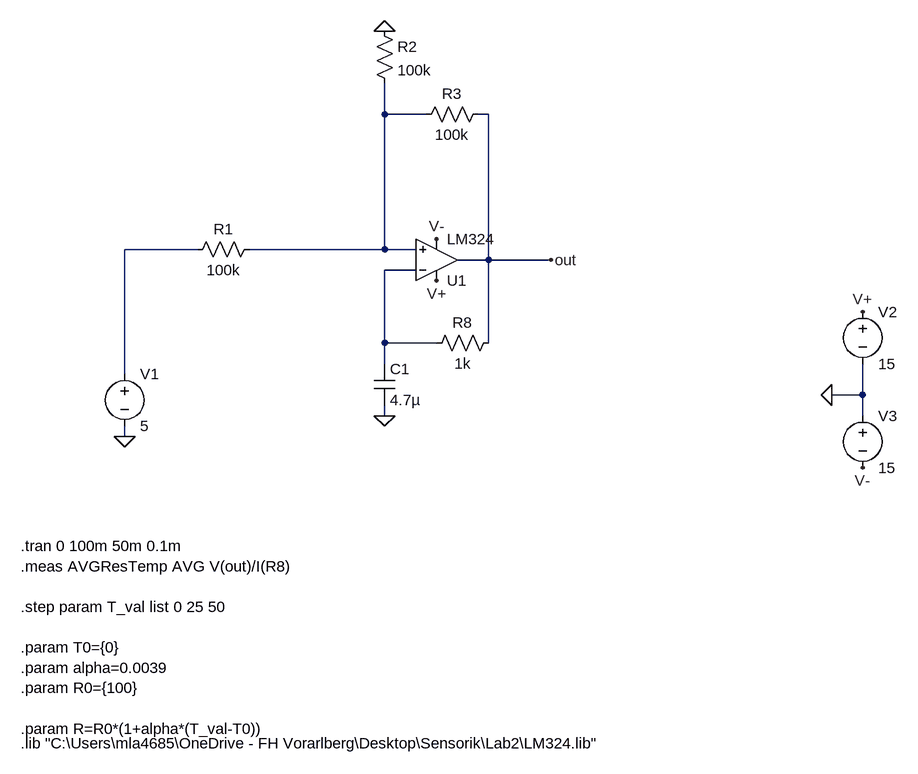
[diagram p0: schematic Umgebung 2.asc]
Umgebung 2.asc, the LTspice schematic file:
Version 4.1
SHEET 1 1784 680
WIRE 432 -320 432 -368
WIRE 496 -320 432 -320
WIRE 592 -320 576 -320
WIRE 144 -112 32 -112
WIRE 432 -112 432 -320
WIRE 432 -112 224 -112
WIRE 480 -112 432 -112
WIRE 592 -96 592 -320
WIRE 592 -96 544 -96
WIRE 688 -96 592 -96
WIRE 480 -80 432 -80
WIRE 432 32 432 -80
WIRE 512 32 432 32
WIRE 592 32 592 -96
WIRE 432 64 432 32
WIRE 32 80 32 -112
WIRE 1168 112 1168 64
WIRE 1168 112 1120 112
WIRE 432 144 432 128
WIRE 1168 144 1168 112
WIRE 32 176 32 160
FLAG 688 -96 out
FLAG 32 176 0
FLAG 1120 112 0
FLAG 1168 -16 V+
FLAG 1168 224 V-
FLAG 512 -128 V-
FLAG 512 -64 V+
FLAG 432 144 0
FLAG 432 -448 0
SYMBOL voltage 32 64 R0
SYMATTR InstName V1
SYMATTR Value 5
SYMBOL res 608 16 R90
WINDOW 0 0 56 VBottom 2
WINDOW 3 32 56 VTop 2
SYMATTR InstName R8
SYMATTR Value 1k
SYMBOL voltage 1168 -32 R0
SYMATTR InstName V2
SYMATTR Value 15
SYMBOL voltage 1168 128 R0
SYMATTR InstName V3
SYMATTR Value 15
SYMBOL res 240 -128 R90
WINDOW 0 0 56 VBottom 2
WINDOW 3 32 56 VTop 2
SYMATTR InstName R1
SYMATTR Value 100k
SYMBOL cap 416 64 R0
SYMATTR InstName C1
SYMATTR Value 4.7µ
SYMBOL res 416 -464 R0
SYMATTR InstName R2
SYMATTR Value 100k
SYMBOL res 592 -336 R90
WINDOW 0 0 56 VBottom 2
WINDOW 3 32 56 VTop 2
SYMATTR InstName R3
SYMATTR Value 100k
SYMBOL Opamps\\opamp2 512 -32 M180
SYMATTR InstName U1
SYMATTR Value LM324
SYMATTR SpiceModel LM324
TEXT -128 344 Left 2 !.tran 0 100m 50m 0.1m
TEXT -128 376 Left 2 !.meas AVGResTemp AVG V(out)/I(R8)\n \n.step param T_val list 0 25 50\n \n.param T0={0}\n.param alpha=0.0039\n.param R0={100}\n \n.param R=R0*(1+alpha*(T_val-T0))
TEXT -128 648 Left 2 !.lib "C:\\Users\\mla4685\\OneDrive - FH Vorarlberg\\Desktop\\Sensorik\\Lab2\\LM324.lib"

The netlist it stands for:
* Umgebung 2.asc
V1 N002 0 5
R8 out N003 1k
V2 V+ 0 15
V3 0 V- 15
R1 N001 N002 100k
C1 N003 0 4.7µ
R2 0 N001 100k
R3 out N001 100k
X§U1 N001 N003 V+ V- out LM324 LM324  ; pins In+ In- V+ V- OUT
.tran 0 100m 50m 0.1m
.meas AVGResTemp AVG V(out)/I(R8)
.step param T_val list 0 25 50
.param T0={0}
.param alpha=0.0039
.param R0={100}
.param R=R0*(1+alpha*(T_val-T0))
.lib "C:\Users\mla4685\OneDrive - FH Vorarlberg\Desktop\Sensorik\Lab2\LM324.lib"
.backanno
.end